# Altium schematic sheet Master schematic.SchDoc
size A; SheetNumber: 1; SheetTotal: 5
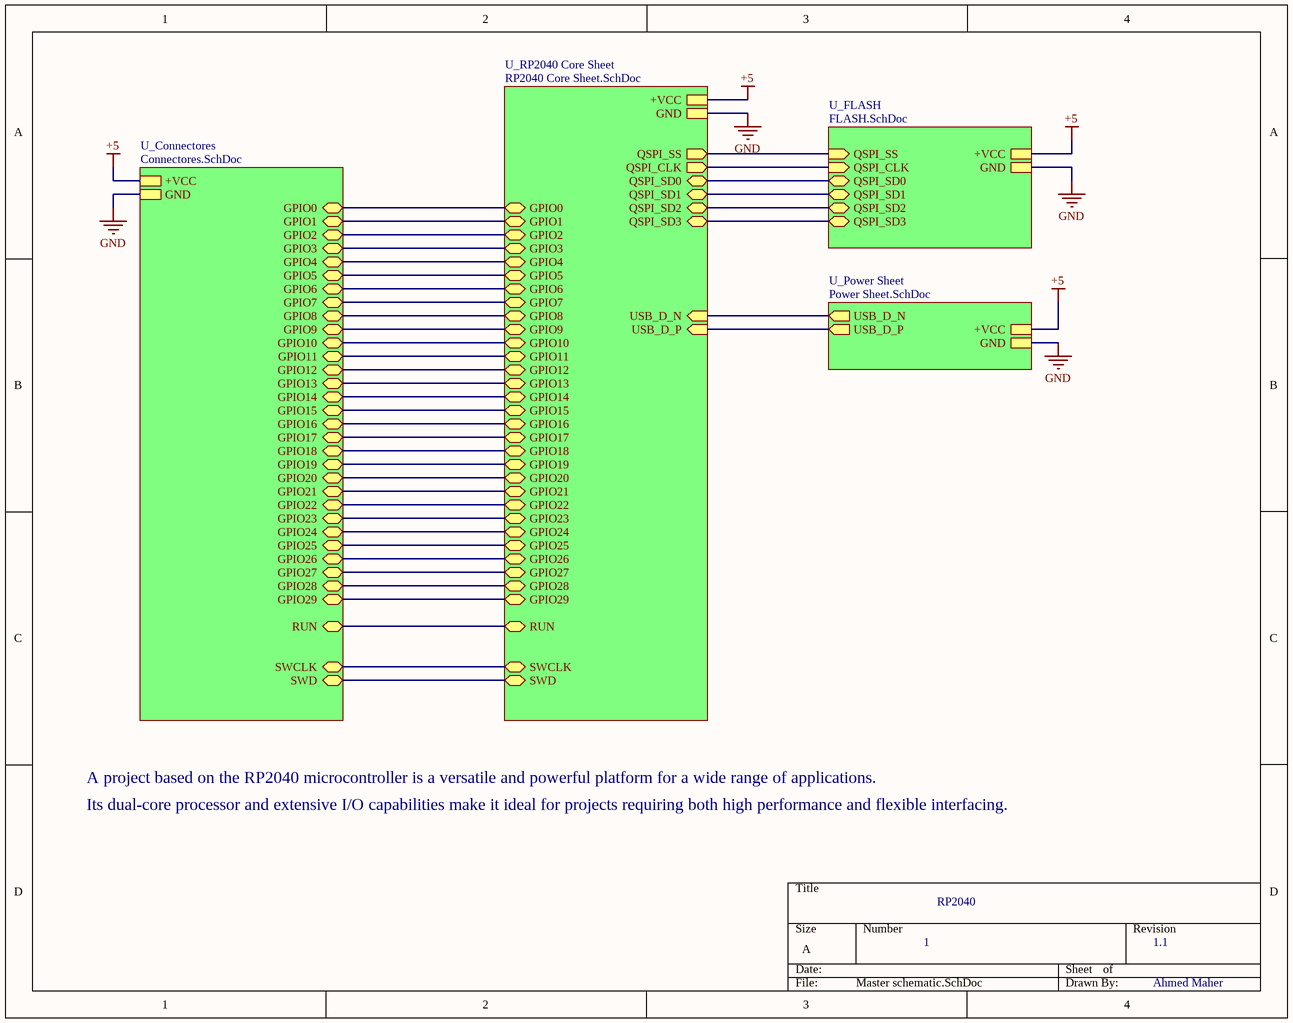
[diagram p0: Master schematic.SchDoc]

## Sub-sheets
U_Connectores = Connectores.SchDoc: +VCC, GND, GPIO0 (bidir), GPIO1 (bidir), GPIO2 (bidir), GPIO3 (bidir), GPIO4 (bidir), GPIO5 (bidir), GPIO6 (bidir), GPIO7 (bidir), GPIO8 (bidir), GPIO9 (bidir), GPIO10 (bidir), GPIO11 (bidir), GPIO12 (bidir), GPIO13 (bidir), GPIO14 (bidir), GPIO15 (bidir), SWCLK (bidir), SWD (bidir), RUN (bidir), GPIO16 (bidir), GPIO18 (bidir), GPIO19 (bidir), GPIO20 (bidir), GPIO21 (bidir), GPIO22 (bidir), GPIO23 (bidir), GPIO24 (bidir), GPIO25 (bidir), GPIO27 (bidir), GPIO28 (bidir), GPIO29 (bidir), GPIO17 (bidir), GPIO26 (bidir)
U_FLASH = FLASH.SchDoc: QSPI_SS (in), QSPI_CLK (in), QSPI_SD0 (bidir), QSPI_SD1 (bidir), QSPI_SD2 (bidir), QSPI_SD3 (bidir), +VCC, GND
U_Power Sheet = Power Sheet.SchDoc: USB_D_P (out), USB_D_N (out), +VCC, GND
U_RP2040 Core Sheet = RP2040 Core Sheet.SchDoc: USB_D_P (in), USB_D_N (in), QSPI_SS (out), QSPI_SD0 (bidir), QSPI_SD1 (bidir), QSPI_SD2 (bidir), QSPI_SD3 (bidir), QSPI_CLK (out), +VCC, GND, GPIO0 (bidir), GPIO1 (bidir), GPIO2 (bidir), GPIO3 (bidir), GPIO4 (bidir), GPIO5 (bidir), GPIO6 (bidir), GPIO7 (bidir), GPIO8 (bidir), GPIO9 (bidir), GPIO10 (bidir), GPIO11 (bidir), GPIO12 (bidir), GPIO13 (bidir), GPIO14 (bidir), GPIO15 (bidir), GPIO16 (bidir), GPIO18 (bidir), GPIO19 (bidir), GPIO20 (bidir), GPIO21 (bidir), GPIO22 (bidir), GPIO23 (bidir), GPIO24 (bidir), GPIO25 (bidir), GPIO17 (bidir), GPIO27 (bidir), GPIO28 (bidir), GPIO29 (bidir), GPIO26 (bidir), RUN (bidir), SWCLK (bidir), SWD (bidir)

## Nets
+5: sheet U_RP2040 Core Sheet/+VCC, sheet U_Connectores/+VCC, sheet U_FLASH/+VCC, sheet U_Power Sheet/+VCC
GND: sheet U_RP2040 Core Sheet/GND, sheet U_Connectores/GND, sheet U_FLASH/GND, sheet U_Power Sheet/GND
(unnamed): sheet U_RP2040 Core Sheet/USB_D_P, sheet U_Power Sheet/USB_D_P
(unnamed): sheet U_RP2040 Core Sheet/USB_D_N, sheet U_Power Sheet/USB_D_N
(unnamed): sheet U_RP2040 Core Sheet/QSPI_SS, sheet U_FLASH/QSPI_SS
(unnamed): sheet U_RP2040 Core Sheet/QSPI_SD0, sheet U_FLASH/QSPI_SD0
(unnamed): sheet U_RP2040 Core Sheet/QSPI_SD1, sheet U_FLASH/QSPI_SD1
(unnamed): sheet U_RP2040 Core Sheet/QSPI_SD2, sheet U_FLASH/QSPI_SD2
(unnamed): sheet U_RP2040 Core Sheet/QSPI_SD3, sheet U_FLASH/QSPI_SD3
(unnamed): sheet U_RP2040 Core Sheet/QSPI_CLK, sheet U_FLASH/QSPI_CLK
(unnamed): sheet U_RP2040 Core Sheet/GPIO0, sheet U_Connectores/GPIO0
(unnamed): sheet U_RP2040 Core Sheet/GPIO1, sheet U_Connectores/GPIO1
(unnamed): sheet U_RP2040 Core Sheet/GPIO2, sheet U_Connectores/GPIO2
(unnamed): sheet U_RP2040 Core Sheet/GPIO3, sheet U_Connectores/GPIO3
(unnamed): sheet U_RP2040 Core Sheet/GPIO4, sheet U_Connectores/GPIO4
(unnamed): sheet U_RP2040 Core Sheet/GPIO5, sheet U_Connectores/GPIO5
(unnamed): sheet U_RP2040 Core Sheet/GPIO6, sheet U_Connectores/GPIO6
(unnamed): sheet U_RP2040 Core Sheet/GPIO7, sheet U_Connectores/GPIO7
(unnamed): sheet U_RP2040 Core Sheet/GPIO8, sheet U_Connectores/GPIO8
(unnamed): sheet U_RP2040 Core Sheet/GPIO9, sheet U_Connectores/GPIO9
(unnamed): sheet U_RP2040 Core Sheet/GPIO10, sheet U_Connectores/GPIO10
(unnamed): sheet U_RP2040 Core Sheet/GPIO11, sheet U_Connectores/GPIO11
(unnamed): sheet U_RP2040 Core Sheet/GPIO12, sheet U_Connectores/GPIO12
(unnamed): sheet U_RP2040 Core Sheet/GPIO13, sheet U_Connectores/GPIO13
(unnamed): sheet U_RP2040 Core Sheet/GPIO14, sheet U_Connectores/GPIO14
(unnamed): sheet U_RP2040 Core Sheet/GPIO15, sheet U_Connectores/GPIO15
(unnamed): sheet U_RP2040 Core Sheet/GPIO16, sheet U_Connectores/GPIO16
(unnamed): sheet U_RP2040 Core Sheet/GPIO18, sheet U_Connectores/GPIO18
(unnamed): sheet U_RP2040 Core Sheet/GPIO19, sheet U_Connectores/GPIO19
(unnamed): sheet U_RP2040 Core Sheet/GPIO20, sheet U_Connectores/GPIO20
(unnamed): sheet U_RP2040 Core Sheet/GPIO21, sheet U_Connectores/GPIO21
(unnamed): sheet U_RP2040 Core Sheet/GPIO22, sheet U_Connectores/GPIO22
(unnamed): sheet U_RP2040 Core Sheet/GPIO23, sheet U_Connectores/GPIO23
(unnamed): sheet U_RP2040 Core Sheet/GPIO24, sheet U_Connectores/GPIO24
(unnamed): sheet U_RP2040 Core Sheet/GPIO25, sheet U_Connectores/GPIO25
(unnamed): sheet U_RP2040 Core Sheet/GPIO17, sheet U_Connectores/GPIO17
(unnamed): sheet U_RP2040 Core Sheet/GPIO27, sheet U_Connectores/GPIO27
(unnamed): sheet U_RP2040 Core Sheet/GPIO28, sheet U_Connectores/GPIO28
(unnamed): sheet U_RP2040 Core Sheet/GPIO29, sheet U_Connectores/GPIO29
(unnamed): sheet U_RP2040 Core Sheet/GPIO26, sheet U_Connectores/GPIO26
(unnamed): sheet U_RP2040 Core Sheet/RUN, sheet U_Connectores/RUN
(unnamed): sheet U_RP2040 Core Sheet/SWCLK, sheet U_Connectores/SWCLK
(unnamed): sheet U_RP2040 Core Sheet/SWD, sheet U_Connectores/SWD

## Notes on the sheet
- A project based on the RP2040 microcontroller is a versatile and powerful platform for a wide range of applications.
- Its dual-core processor and extensive I/O capabilities make it ideal for projects requiring both high performance and flexible interfacing.
- RP2040
- 1
- 1.1
- Ahmed Maher